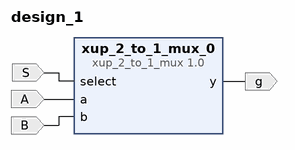
[diagram p0: block diagram of the top level]
# Vivado block design design_1, xc7a35tcpg236-1, Vivado 2019.1
create_bd_design design_1

create_bd_port -dir I S
create_bd_port -dir O g
create_bd_port -dir I A
create_bd_port -dir I B

create_bd_cell -type ip -vlnv xilinx.com:xup:xup_2_to_1_mux:1.0 xup_2_to_1_mux_0

# ---- connections ----

connect_bd_net [get_bd_ports S] [get_bd_pins xup_2_to_1_mux_0/select]
connect_bd_net [get_bd_pins xup_2_to_1_mux_0/y] [get_bd_ports g]
connect_bd_net [get_bd_ports A] [get_bd_pins xup_2_to_1_mux_0/a]
connect_bd_net [get_bd_ports B] [get_bd_pins xup_2_to_1_mux_0/b]

validate_bd_design
save_bd_design
